# EAGLE design Board_v2_Round_Team_1 (EAGLE 8.1.0)
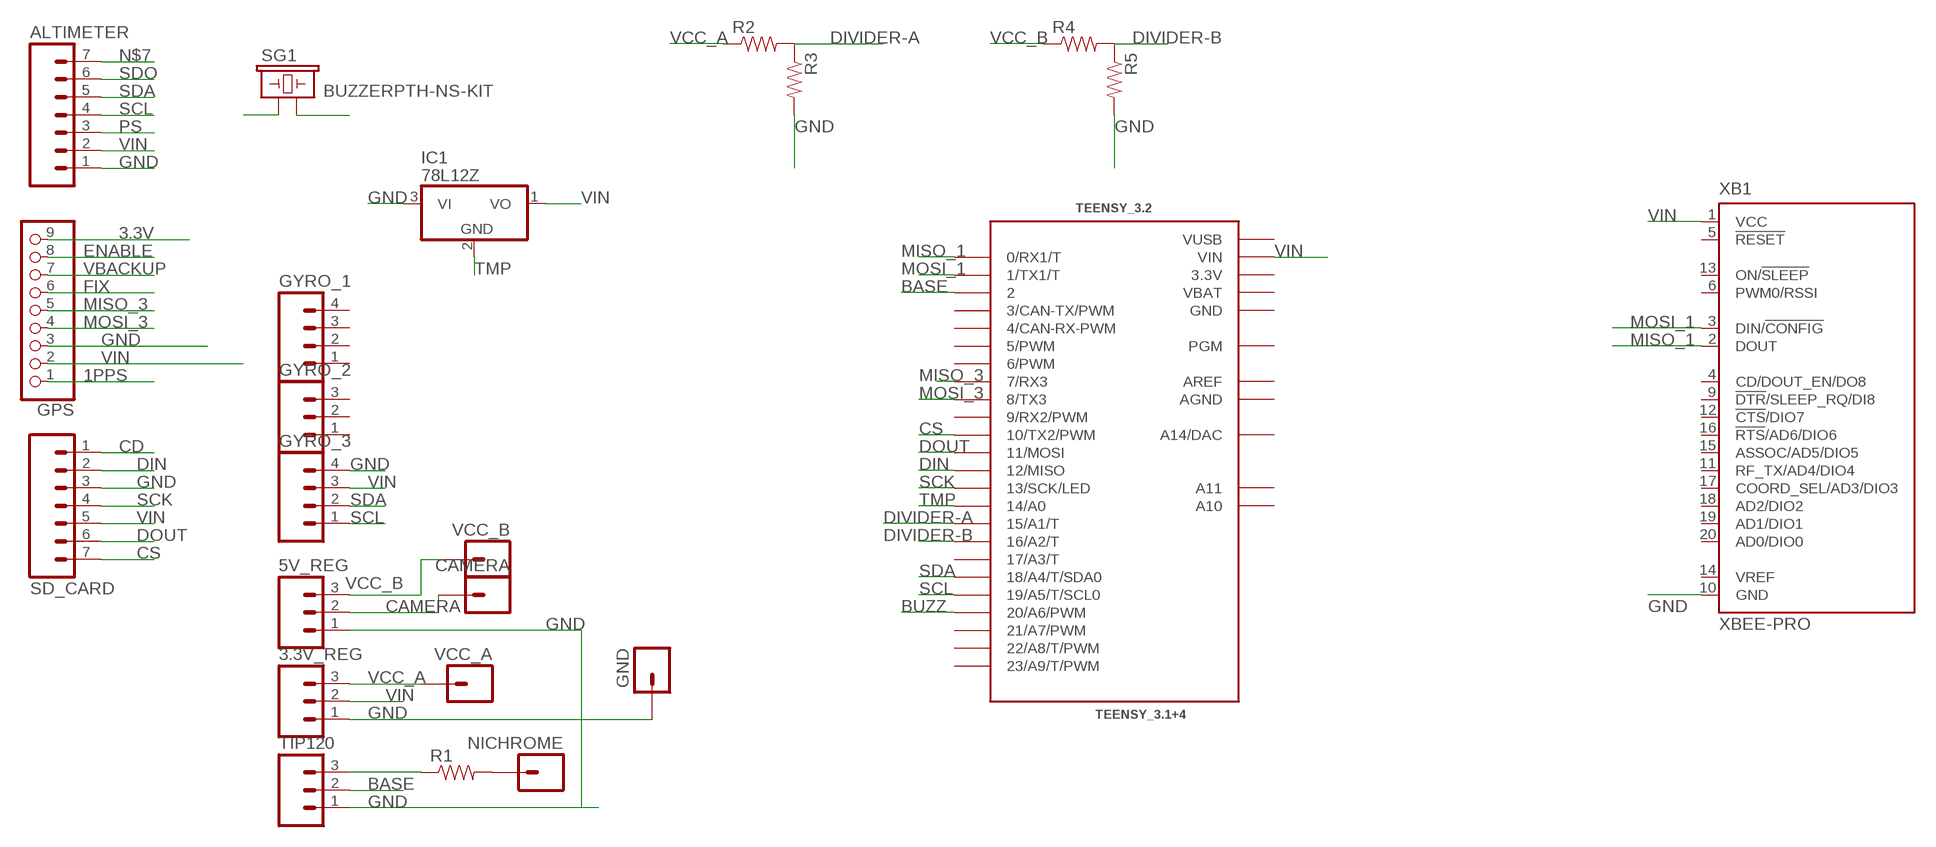
[diagram p0: schematic, sheet 1]

## Parts
3.3V_REG  M03PTH  [1X03]
5V_REG  M03PTH  [1X03]
ALTIMETER  M07  [1X07]
CAMERA  M01NOSILK-KIT  [1X01NS-KIT]
GND  M01PTH_LONGPAD  [1X01_LONGPAD]
GPS  HEADER-1X970MIL  [1X09_ROUND_70]
GYRO_1  M04PTH  [1X04]
GYRO_2  M03PTH  [1X03]
GYRO_3  M04PTH  [1X04]
IC1  78L12Z  [TO92]
NICHROME  M01PTH_LONGPAD  [1X01_LONGPAD]
R1  RESISTOREZ  [AXIAL-0.3EZ]
R2  RESISTORAXIAL-0.3  [AXIAL-0.3]
R3  RESISTORAXIAL-0.3  [AXIAL-0.3]
R4  RESISTORAXIAL-0.3  [AXIAL-0.3]
R5  RESISTORAXIAL-0.3  [AXIAL-0.3]
SD_CARD  M07  [1X07]
SG1  BUZZERPTH-NS-KIT  [BUZZER-12MM-NS-KIT]
TEENSY_3.2  TEENSY_3.1+4  [TEENSY_3.1+4]
TIP120  M03PTH  [1X03]
VCC_A  M01PTH_LONGPAD  [1X01_LONGPAD]
VCC_B  M01OFFSET  [1X01_OFFSET]
XB1  XBEE-PRO  [XBEE-PRO]

## Nets
1PPS: GPS.1
3.3V: GPS.9
BASE: TEENSY_3.2.2 TIP120.2
BUZZ: SG1.+ TEENSY_3.2.20/A6(20/A6/PWM)
CAMERA: 5V_REG.2 CAMERA.1
CD: SD_CARD.1
CS: SD_CARD.7 TEENSY_3.2.10(10/TX2/PWM)
DIN: SD_CARD.2 TEENSY_3.2.12(12/MISO)
DIVIDER-A: R2.P$2 R3.P$1 TEENSY_3.2.15/A1(15/A1/T)
DIVIDER-B: R4.P$2 R5.P$1 TEENSY_3.2.16/A2(16/A2/T)
DOUT: SD_CARD.6 TEENSY_3.2.11(11/MOSI)
ENABLE: GPS.8
FIX: GPS.6
GND: 3.3V_REG.1 5V_REG.1 ALTIMETER.1 GND.1 GPS.3 GYRO_3.4 IC1.3(VI) R3.P$2 R5.P$2 SD_CARD.3 SG1.- TIP120.1 XB1.10(GND)
MISO_1: TEENSY_3.2.0(0/RX1/T) XB1.2(DOUT)
MISO_3: GPS.5 TEENSY_3.2.7(7/RX3)
MOSI_1: TEENSY_3.2.1(1/TX1/T) XB1.3(DIN/!CONFIG)
MOSI_3: GPS.4 TEENSY_3.2.8(8/TX3)
N$1: NICHROME.1 R1.P$2
N$2: R1.P$1 TIP120.3
N$7: ALTIMETER.7
PS: ALTIMETER.3
SCK: SD_CARD.4 TEENSY_3.2.13(13/SCK/LED)
SCL: ALTIMETER.4 GYRO_3.1 TEENSY_3.2.19/A5(19/A5/T/SCL0)
SDA: ALTIMETER.5 GYRO_3.2 TEENSY_3.2.18/A4(18/A4/T/SDA0)
SDO: ALTIMETER.6
TMP: IC1.2(GND) TEENSY_3.2.14/A0
VBACKUP: GPS.7
VCC_A: 3.3V_REG.3 R2.P$1 VCC_A.1
VCC_B: 5V_REG.3 R4.P$1 VCC_B.1
VIN: 3.3V_REG.2 ALTIMETER.2 GPS.2 GYRO_3.3 IC1.1(VO) SD_CARD.5 TEENSY_3.2.VIN XB1.1(VCC)
Unconnected: GYRO_1.1 GYRO_1.2 GYRO_1.3 GYRO_1.4 GYRO_2.1 GYRO_2.2 GYRO_2.3 TEENSY_3.2.3(3/CAN-TX/PWM) TEENSY_3.2.4(4/CAN-RX-PWM) TEENSY_3.2.5(5/PWM) TEENSY_3.2.6(6/PWM) TEENSY_3.2.9(9/RX2/PWM) TEENSY_3.2.17/A3(17/A3/T) TEENSY_3.2.21/A7(21/A7/PWM) TEENSY_3.2.22/A8(22/A8/T/PWM) TEENSY_3.2.23/A9(23/A9/T/PWM) TEENSY_3.2.A10 TEENSY_3.2.A11 TEENSY_3.2.A14(A14/DAC) TEENSY_3.2.PGM XB1.4(CD/DOUT_EN/DO8) XB1.5(!RESET) XB1.6(PWM0/RSSI) XB1.9(!DTR!/SLEEP_RQ/DI8) XB1.11(RF_TX/AD4/DIO4) XB1.12(!CTS!/DIO7) XB1.13(ON/!SLEEP) XB1.14(VREF) XB1.15(ASSOC/AD5/DIO5) XB1.16(!RTS!/AD6/DIO6) XB1.17(COORD_SEL/AD3/DIO3) XB1.18(AD2/DIO2) XB1.19(AD1/DIO1) XB1.20(AD0/DIO0)

## Power pins joined to a net without a drawn wire
3.3V: TEENSY_3.2.3.3V TEENSY_3.2.3.3V1(3.3V)
AGND: TEENSY_3.2.AGND
AREF: TEENSY_3.2.AREF
GND: TEENSY_3.2.GND TEENSY_3.2.GND1(GND)
VBAT: TEENSY_3.2.VBAT
VUSB: TEENSY_3.2.VUSB

## Library data of the parts
3.3V_REG 5V_REG GYRO_2 TIP120 = SparkFun-Connectors:M03: Header 3 Standard 3-pin 0.1" header. Use with straight break away headers (SKU : PRT-00116), right angle break away headers (PRT-00553), swiss pins (PRT-00743), machine pins (PRT-00117), and female headers (PRT-00115). Molex polarized connector foot print use with SKU : PRT-08232 with associated crimp pins and housings.
ALTIMETER SD_CARD = SparkFun-Connectors:M07: Header 7 Standard 7-pin 0.1" header. Use with straight break away headers (SKU : PRT-00116), right angle break away headers (PRT-00553), swiss pins (PRT-00743), machine pins (PRT-00117), and female headers (PRT-00115). NOTES ON THE VARIANTS LOCK and LOCK_LONGPADS... This footprint was designed to help hold the alignment of a through-hole component (i.e. 7-pin header) while soldering it into place. You may notice that each hole has been shifted either up or down by 0.005 of an inch from it's more standard position (which is usually a perfectly straight line). This slight alteration caused the pins (the squares in the middle) to touch the edges of the holes. Because they are alternating, it causes a "brace" to hold the header in place. 0.005 has proven to be the perfect amount of "off-center" position when using our standard breakaway headers. Although looks a little odd when you look at the bare footprint, once you have a header in there, the alteration is very hard to notice. Also, if you push a header all the way into place, it is covered up entirely on the bottom side. This idea of altering the position of holes to aid alignment will be further integrated into the Sparkfun Library for other footprints. It can help hold any component with 3 or more connection pins.
CAMERA GND NICHROME VCC_A VCC_B = SparkFun-Connectors:M01: Header 1 Standard 1-pin 0.1" header. Use with straight break away headers (SKU : PRT-00116), right angle break away headers (PRT-00553), swiss pins (PRT-00743), machine pins (PRT-00117), and female headers (PRT-00115). SMTSO-256-ET is a "flush mount" nut for a 4-40 screw. The older package used to be too tight, and did not allow it to sit properly thru the drill hit. The latest (0.165DIA) fits nice and snug.
GPS = microbuilder:HEADER-1X9: PIN HEADER
GYRO_1 GYRO_3 = SparkFun-Connectors:M04: Header 4 Standard 4-pin 0.1" header. Use with straight break away headers (SKU : PRT-00116), right angle break away headers (PRT-00553), swiss pins (PRT-00743), machine pins (PRT-00117), and female headers (PRT-00115). Molex polarized connector foot print use with SKU : PRT-08231 with associated crimp pins and housings. 1MM SMD Version SKU: PRT-10208; PROD_ID: CONN-09696
IC1 = adafruit:78*: Positive VOLTAGE REGULATOR Added bigger pads to the TO-92 package
R1 = SparkFun-Passives:RESISTOR: Resistor Basic schematic elements and footprints for 0603, 1206, and PTH resistors.
R2-R5 = SparkFun-Resistors:RESISTOR: Resistor Basic schematic elements and footprints for 0603, 1206, and PTH resistors.
SG1 = SparkFun:BUZZER: Buzzer 12mm Spark Fun Electronics SKU : Comp-Buzzer
TEENSY_3.2 = Teensy_3_Series_Board_v1.0:TEENSY_3.1+4: Footprint for Teensy 3.1 board using all through-holes, i.e. the entire perimeter plus the 4 through-holes inboard (A10,A11,AREF, VUSB)
XB1 = maxstream:XBEE: XBee (TM) /XBee-PRO(TM) OEM RF Modules Source: MaxStream, Inc. xbee_productmanual.pdf; MPN: XBP24-AWI-001; OC_FARNELL: 1337916; OC_NEWARK: 42M2667

## Board
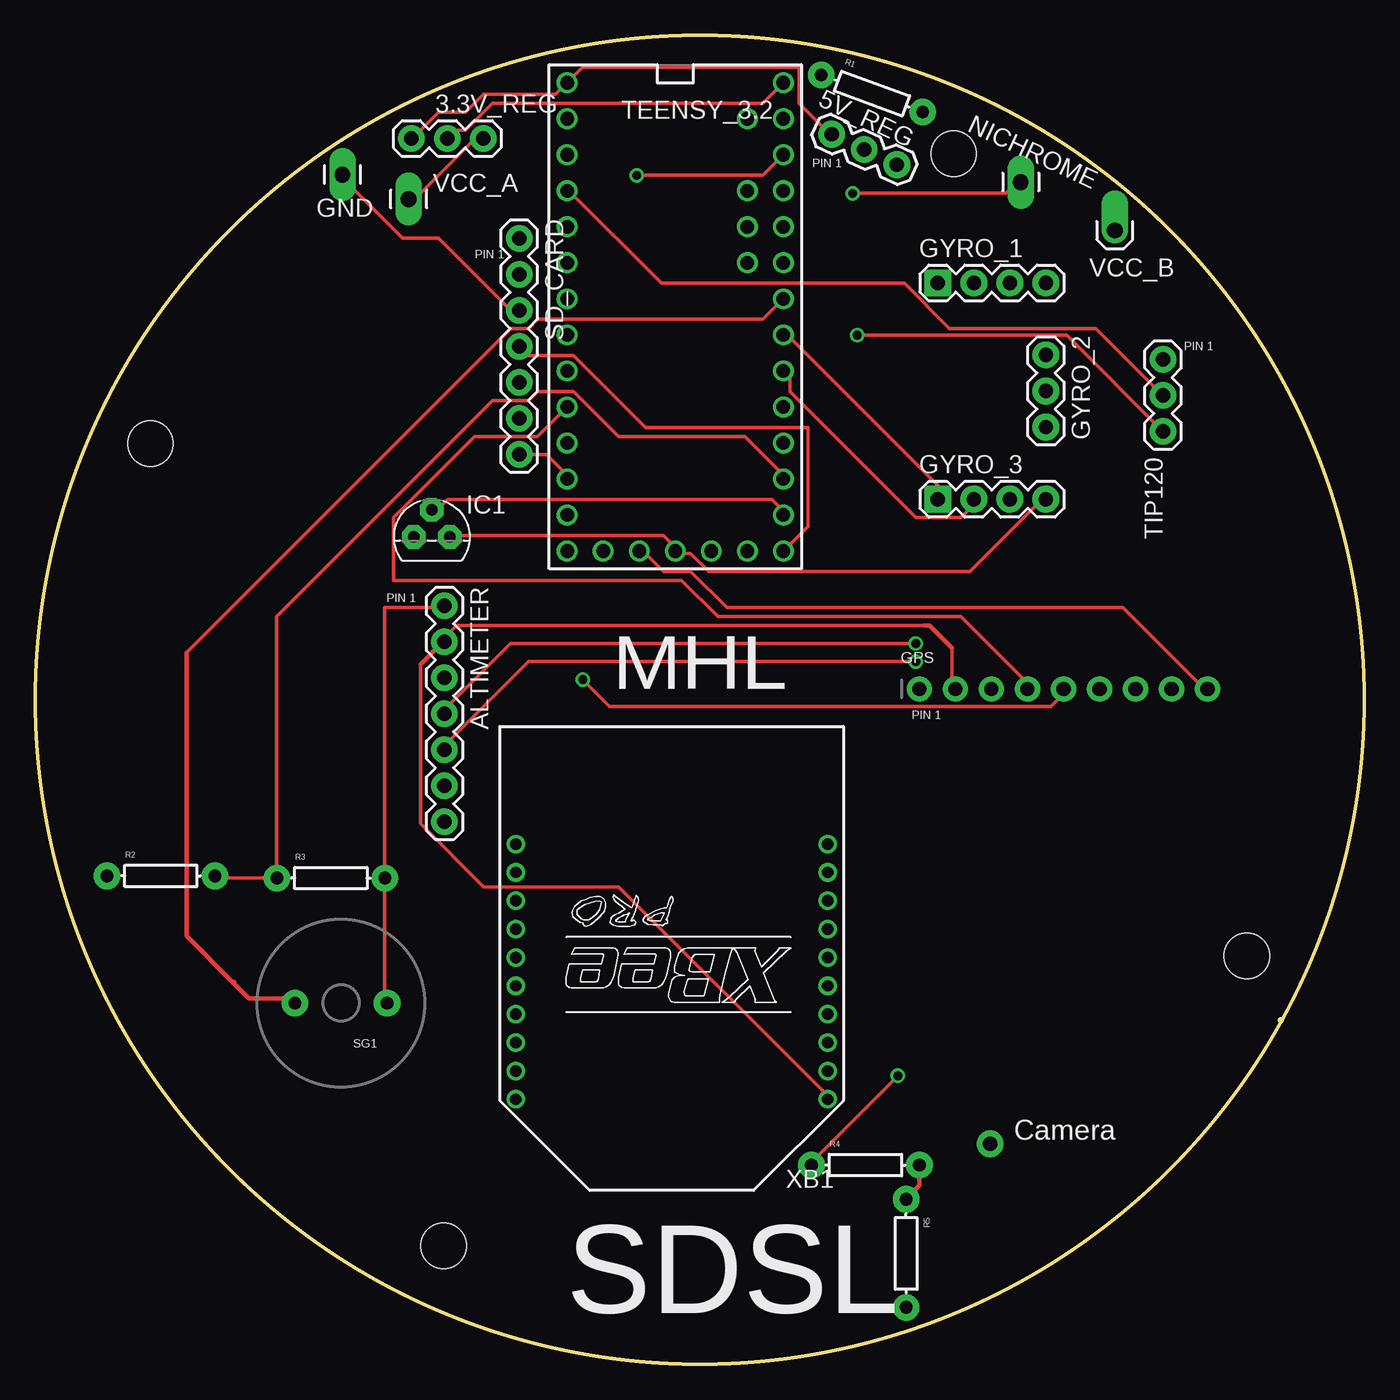
[diagram p1: board, top side]
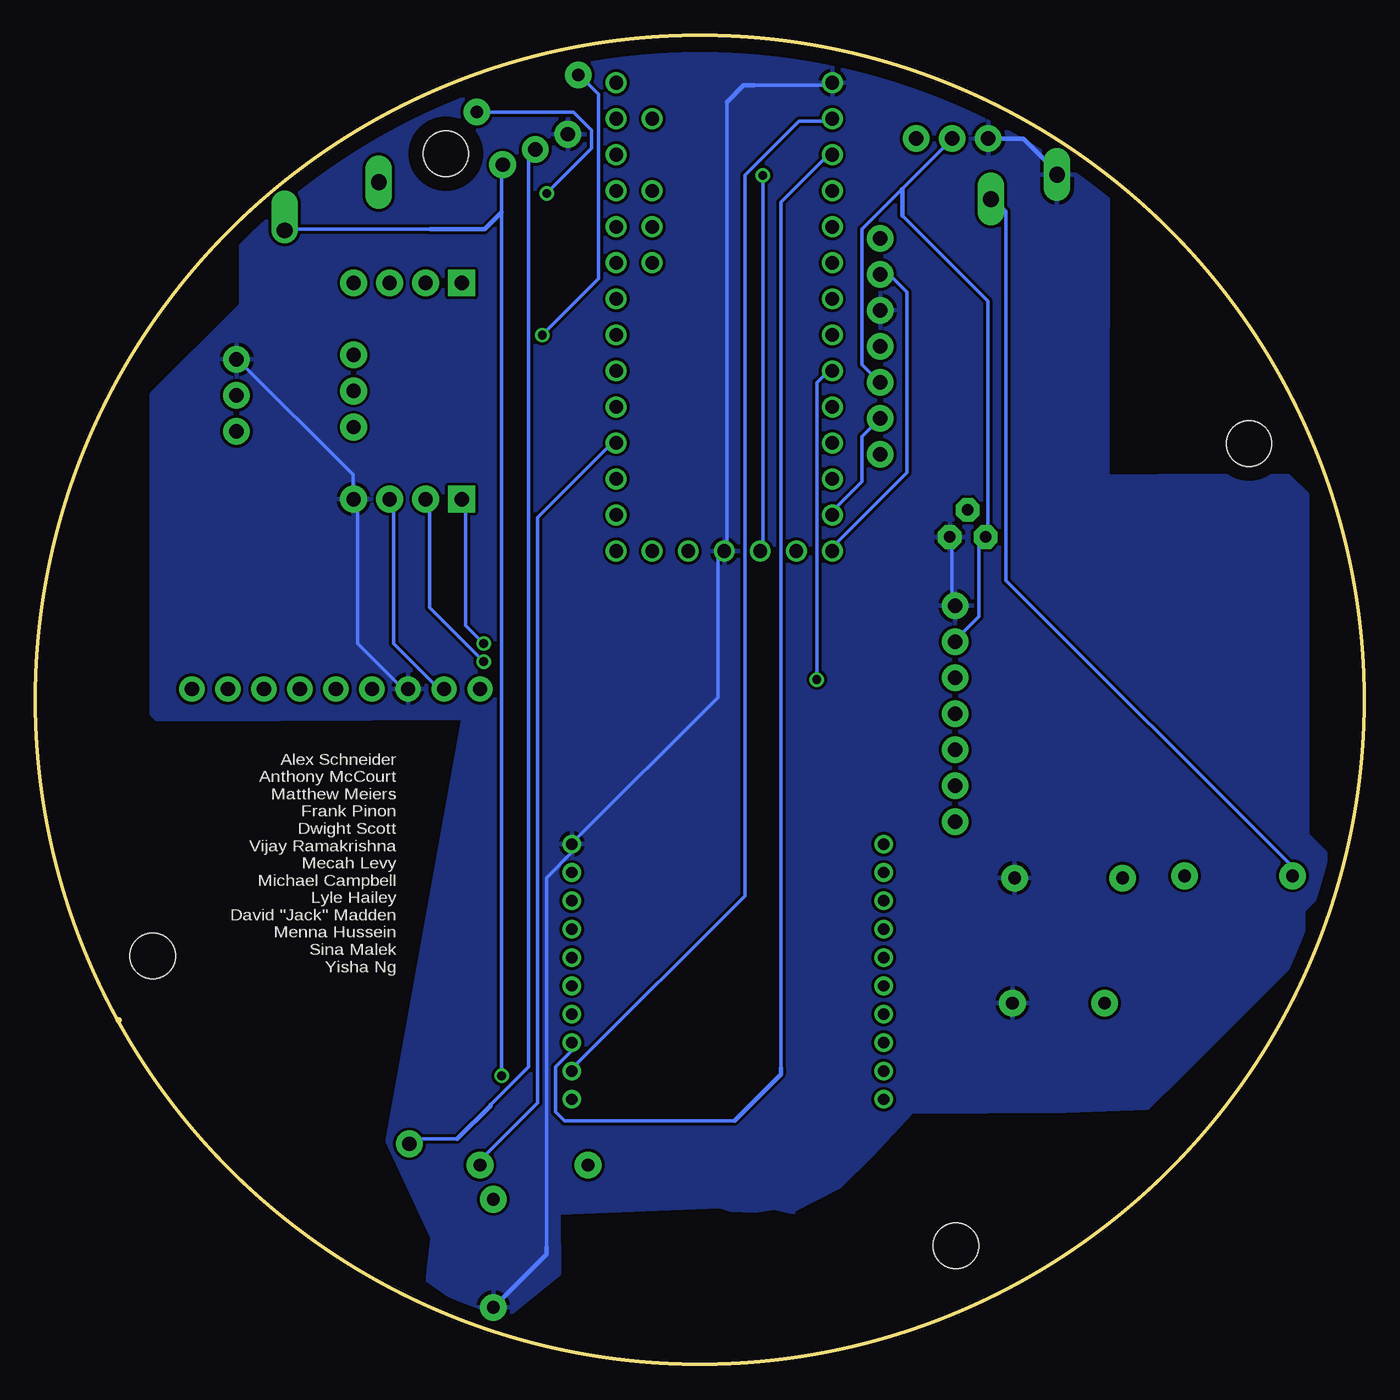
[diagram p2: board, bottom side, seen from below]

Size 93.69 x 93.69 mm. Coordinates in mm from the lower left corner, seen from the top.
Outline: 87.82,24.26 87.81,24.24
Outline: circle at 46.84,46.84 radius 46.84
Copper layers (1*16): Top 0.035mm / dielectric 1.5mm / Bottom 0.035mm
Design rules "default": minimum track width 10mil, minimum drill 24mil, track to track 8mil, track to pad 8mil, pad to pad 8mil, via to via 8mil, smd to smd 8mil, copper to edge 40mil, drill to drill 8mil, minimum pad ring 10mil, minimum via ring 8mil, stop-mask expansion 4mil, vias tented up to drill 0mil, thermal gap 10mil
Holes 3.2 mm at 64.75,85.35 85.43,28.78 8.11,64.9 28.78,8.34

### Footprints (pad centres in the part's own frame; a part is rotated, then mirrored left to right if it is on the bottom)
1X03 = drill 1.016 pad 1.88: 1 0,0; 2 2.54,0; 3 5.08,0
1X07 = drill 1.016 pad 1.88: 1 0,0; 2 2.54,0; 3 5.08,0; 4 7.62,0; 5 10.16,0; 6 12.7,0; 7 15.24,0
1X01NS-KIT = drill 1.016 pad 1.88: 1 0,0
1X01_LONGPAD = drill 1.118 pad 1.88 long: 1 0,0
1X09_ROUND_70 = drill 1 pad 1.778: 1 -10.16,0; 2 -7.62,0; 3 -5.08,0; 4 -2.54,0; 5 0,0; 6 2.54,0; 7 5.08,0; 8 7.62,0; 9 10.16,0
1X04 = drill 1.016 pad 1.88 square: 1 0,0 | drill 1.016 pad 1.88: 2 2.54,0; 3 5.08,0; 4 7.62,0
TO92 = drill 0.813 pad 1.676 octagon: 1 -1.27,0; 2 0,1.905; 3 1.27,0
AXIAL-0.3EZ = drill 0.9 pad 1.88: P$1 -3.81,0; P$2 3.81,0
AXIAL-0.3 = drill 0.9 pad 1.88: P$1 -3.81,0; P$2 3.81,0
BUZZER-12MM-NS-KIT = drill 0.9 pad 1.88: + 3.25,0; - -3.25,0
TEENSY_3.1+4 = drill 0.965: 0 -7.62,15.24; 1 -7.62,12.7; 2 -7.62,10.16; 3 -7.62,7.62; 3.3V 7.62,12.7; 3.3V1 -2.54,-15.24; 4 -7.62,5.08; 5 -7.62,2.54; 6 -7.62,0; 7 -7.62,-2.54; 8 -7.62,-5.08; 9 -7.62,-7.62; 10 -7.62,-10.16; 11 -7.62,-12.7; 12 -7.62,-15.24; 13 7.62,-15.24; 14/A0 7.62,-12.7; 15/A1 7.62,-10.16; 16/A2 7.62,-7.62; 17/A3 7.62,-5.08; 18/A4 7.62,-2.54; 19/A5 7.62,0; 20/A6 7.62,2.54; 21/A7 7.62,5.08; 22/A8 7.62,7.62; 23/A9 7.62,10.16; A10 5.08,7.62; A11 5.08,5.08; A14 5.08,-15.24; AGND 7.62,15.24; AREF 5.08,10.16; GND -7.62,17.78; GND1 0,-15.24; PGM 2.54,-15.24; VBAT -5.08,-15.24; VIN 7.62,17.78; VUSB 5.08,15.24
1X01_OFFSET = drill 1.118 pad 1.88 offset: 1 0,0
XBEE-PRO = drill 0.8 pad 1.27: 1 -11,9; 2 -11,7; 3 -11,5; 4 -11,3; 5 -11,1; 6 -11,-1; 7 -11,-3; 8 -11,-5; 9 -11,-7; 10 -11,-9; 11 11,-9; 12 11,-7; 13 11,-5; 14 11,-3; 15 11,-1; 16 11,1; 17 11,3; 18 11,5; 19 11,7; 20 11,9

### Placement (x,y rotation side)
3.3V_REG  26.5,86.42 0 top
5V_REG  56.14,86.72 335 top
ALTIMETER  28.84,53.47 270 top
CAMERA  67.32,15.53 0 top
GND  21.65,83.88 180 top
GPS  72.5,47.61 0 top
GYRO_1  63.63,76.23 0 top
GYRO_2  71.25,71.15 270 top
GYRO_3  63.63,60.99 0 top
IC1  27.95,58.32 0 top
NICHROME  69.48,83.34 0 top
R1  58.99,89.59 340 top
R2  8.85,34.42 0 top
R3  20.83,34.27 0 top
R4  58.53,14.03 0 top
R5  61.4,7.8 270 top
SD_CARD  34.12,79.38 270 top
SG1  21.55,25.46 180 top
TEENSY_3.2  45.12,72.57 0 top
TIP120  79.51,70.85 270 top
VCC_A  26.32,82.15 180 top
VCC_B  76.1,79.94 0 top
XB1  44.86,27.67 180 top

### Tracks (layer width: path | path; a pad name or v marks a point on that pad's centre or on a via)
3.3V  (via drill 0.61)
  Top 0.254: TEENSY_3.2.3.3V1 43.03,57.16 44.3,55.89 46.21,55.89 48.75,53.35 76.69,53.35 82.4,47.63 GPS.9 | TEENSY_3.2.3.3V 51.29,83.83 v42.4,83.83
  Bottom 0.254: v42.4,83.83 42.4,57.79 TEENSY_3.2.3.3V1
BASE
  Top 0.254: TIP120.2 74.78,73.03 64.47,73.03 61.29,76.21 44.15,76.21 37.64,82.72 TEENSY_3.2.2
BUZZ
  Top 0.254: TEENSY_3.2.20/A6 51.29,73.67 35.41,73.67 34.78,73.03 33.51,73.03 10.65,50.17 | SG1.+ 18.27,26.04 | 14,26.93 13.98,26.99 13.91,26.92
  Top 0.305: 14,26.93 14,26.83 | SG1.+ 17.97,25.79 15.04,25.79 13.91,26.92 10.65,30.18 10.65,50.17
CAMERA
  Bottom 0.254: 63.94,15.88 67.16,15.88 CAMERA.1 | 61.6,18.27 58.91,20.96 58.91,85.1 5V_REG.2
  Bottom 0.305: 61.6,18.27 61.6,18.22 63.94,15.88
CS
  Top 0.254: SD_CARD.7 36.05,64.14 37.32,62.87 TEENSY_3.2.10
DIN
  Bottom 0.254: TEENSY_3.2.12 37.32,57.79 32.24,62.87 32.24,75.57 33.51,76.84 SD_CARD.2
DIVIDER-A
  Top 0.254: TEENSY_3.2.15/A1 52.56,62.87 50.02,65.41 41.13,65.41 37.95,68.59 35.41,68.59 34.78,67.95 32.24,67.95 17,52.71 17,34.3 R3.P$1 16.36,34.3 12.55,34.3 R2.P$2
DIVIDER-B
  Top 0.305: R4.P$2 62.34,12.6 61.4,11.67 R5.P$1
  Bottom 0.254: TEENSY_3.2.16/A2 53.19,64.78 58.27,59.7 58.27,18.42 62.08,14.61 R4.P$2
DOUT
  Bottom 0.254: TEENSY_3.2.11 37.32,60.33 35.41,62.24 35.41,65.41 34.14,66.68 SD_CARD.6
GND
  Top 0.254: 3.3V_REG.1 26.52,87 27.16,87 28.43,88.27 30.33,88.27 31.6,89.54 36.68,89.54 TEENSY_3.2.GND 38.59,91.45 53.83,91.45 53.83,88.91 55.73,87 5V_REG.1 | SD_CARD.3 33.51,74.3 28.43,79.38 25.89,79.38 21.44,83.83 GND.1 | SG1.- 24.62,26.04 24.62,33.66 R3.P$2 24.62,34.3 24.62,53.35 28.43,53.35 ALTIMETER.1 | IC1.3 29.7,58.43 44.3,58.43 44.94,57.79 TEENSY_3.2.GND1 45.57,57.16 46.21,57.16 47.48,55.89 65.89,55.89 70.97,60.97 GYRO_3.4
  Bottom 0.254: 22.08,84.46 GND.1 | GPS.3 67.8,47.63 70.97,50.81 70.97,60.97 GYRO_3.4 71.29,61.13 71.29,62.71 79.39,70.81 TIP120.1 | IC1.3 29.06,57.79 29.06,53.98 ALTIMETER.1 | 57.64,8.26 57.64,34.3 55.73,36.2 XB1.10 55.73,36.84 45.57,47 45.57,57.16 TEENSY_3.2.GND1 44.94,57.79 44.94,88.98 | 42.98,90.18 37.95,90.18 TEENSY_3.2.GND
  Bottom 0.305: 42.98,90.18 43.75,90.18 44.94,88.98 | 3.3V_REG.1 24.04,86.42 22.08,84.46 | 57.64,8.26 57.64,7.75 R5.P$2
  pour Bottom: 45.37,11.11 56.8,10.65 56.78,6.38 61.4,2.62 66.02,5.9 65.67,8.95 68.87,15.73 63.48,45.55 76.44,45.5 85.15,45.5 85.48,45.83 85.48,68.38 79.18,74.68 79.18,80.47 77.12,82.53 77.02,82.53 76.21,83.34 76.05,83.34 75.77,83.62 75.65,83.62 75.01,84.26 74.81,84.26 74.23,84.84 74,84.84 73.51,85.33 73.36,85.33 72.93,85.76 72.65,85.76 72.32,86.09 72.07,86.09 71.84,86.32 71.33,86.32 71.08,86.57 70.67,86.57 70.44,86.8 69.78,86.8 69.3,87.28 69.07,87.28 68.92,87.43 67.55,87.43 66.94,88.04 66.71,88.04 66.28,88.47 65.26,88.47 64.93,88.8 64.88,88.8 64.34,89.34 64.22,89.34 63.68,89.87 63.25,89.87 63.15,89.97 61.8,89.97 61.2,90.58 60.99,90.58 60.61,90.96 58.63,90.96 57.39,92.21 54.79,92.21 54.36,92.64 37.45,92.64 37.01,92.21 35.57,92.21 34.8,91.45 32.06,91.45 31.3,90.68 30.28,90.68 28.99,89.39 27.57,89.39 27.03,88.86 26.3,88.86 25.74,88.3 25.18,88.3 24.54,87.66 24.06,87.66 23.25,86.85 22.41,86.85 21.75,86.19 21.57,86.19 21.14,85.76 20.73,85.76 20.38,85.4 20.38,85.22 20.33,85.17 20.17,85.17 19.97,84.97 19.74,84.97 19.26,84.49 19.26,83.83 18.07,82.63 18.07,79.66 18.12,66.38 18.09,62.59 11.03,62.64 10.85,62.62 5.34,62.62 4.02,61.3 4.02,37.29 2.75,36.02 2.75,33.53 4.3,31.99 4.3,29.01 12.83,20.48 15.27,18.07 21.04,17.86 31.91,17.79 34.75,14.74 36.99,12.53 40.32,10.83 40.24,10.7 41.59,11.03 42.96,10.8 44.63,10.88
MISO_1
  Bottom 0.254: XB1.2 55.73,20.96 43.67,33.03 43.67,83.83 39.86,87.64 37.95,87.64 TEENSY_3.2.0
MISO_3  (via drill 0.61)
  Top 0.254: v38.59,48.27 40.49,46.36 71.61,46.36 72.24,47 GPS.5
  Bottom 0.254: v38.59,48.27 38.59,69.22 37.95,69.86 TEENSY_3.2.7
MOSI_1
  Bottom 0.254: 44.41,17.15 56.37,17.15 57,17.79 57,20.96 55.73,22.23 XB1.3 | 41.13,20.89 41.13,81.92 37.95,85.1 TEENSY_3.2.1
  Bottom 0.305: 41.13,20.89 41.13,20.43 44.41,17.15
MOSI_3
  Top 0.254: TEENSY_3.2.8 35.41,65.41 30.97,65.41 25.25,59.7 25.25,55.25 45.57,55.25 48.11,52.71 65.26,52.71 70.34,47.63 GPS.4
N$1  (via drill 0.61)
  Top 0.254: v57.64,82.56 68.43,82.56 69.07,83.19 NICHROME.1
  Bottom 0.254: v57.64,82.56 54.46,85.73 54.46,87 55.73,88.27 62.08,88.27 R1.P$2
N$2  (via drill 0.61)
  Top 0.254: TIP120.3 72.72,72.56 v57.96,72.56
  Bottom 0.254: v57.96,72.56 53.99,76.52 53.99,89.54 55.26,90.81 R1.P$1
SCK
  Top 0.254: TEENSY_3.2.13 54.46,59.06 54.46,66.05 43.03,66.05 37.95,71.13 34.78,71.13 34.14,71.76 SD_CARD.4
SCL  (via drill 0.61)
  Top 0.254: TEENSY_3.2.19/A5 53.19,72.4 63.99,61.6 GYRO_3.1 | v62.08,50.81 33.51,50.81 29.06,46.36 ALTIMETER.4
  Bottom 0.254: v62.08,50.81 63.35,52.08 63.35,60.97 GYRO_3.1
SDA  (via drill 0.61)
  Top 0.254: TEENSY_3.2.18/A4 53.19,69.86 53.19,68.59 62.08,59.7 65.26,59.7 66.53,60.97 GYRO_3.2 | v62.08,49.54 34.78,49.54 29.06,43.82 ALTIMETER.5
  Bottom 0.254: v62.08,49.54 65.89,53.35 65.89,60.97 GYRO_3.2
TMP
  Top 0.254: TEENSY_3.2.14/A0 52.56,60.33 51.92,60.97 29.06,60.97 28.43,60.33 IC1.2
VCC_A
  Top 0.254: 3.3V_REG.3 30.97,86.37 27.16,82.56 26.52,82.56 VCC_A.1
  Bottom 0.254: R2.P$1 4.93,34.93 25.25,55.25 25.25,81.29 25.89,81.92 VCC_A.1
VCC_B  (via drill 0.61)
  Top 0.254: v60.81,20.33 55.1,14.61 R4.P$1
  Bottom 0.254: v60.81,20.33 60.81,81.24 60.81,84.46 5V_REG.3 | 65.87,80.02 76.05,80.02 VCC_B.1
  Bottom 0.305: 65.87,80.02 62.03,80.02 60.81,81.24
VIN
  Top 0.254: TEENSY_3.2.VIN 51.29,88.91 32.24,88.91 30.33,87 29.06,87 3.3V_REG.2 | 27.16,49.33 27.16,38.11 31.6,33.66 41.13,33.66 55.73,19.06 XB1.1 | 64.62,50.48 64.62,47.63 GPS.2 | 62.67,52.08 29.7,52.08 29.06,51.44 ALTIMETER.2
  Top 0.305: 62.67,52.08 63.02,52.08 64.62,50.48 | ALTIMETER.2 28.76,50.93 27.16,49.33
  Bottom 0.254: SD_CARD.5 34.14,69.22 35.41,70.49 35.41,80.02 32.58,82.85 29.06,86.37 3.3V_REG.2 | GPS.2 65.26,47.63 68.43,50.81 68.43,60.97 GYRO_3.3 | ALTIMETER.2 28.43,51.44 27.16,52.71 27.16,57.79 IC1.1 26.52,58.43 26.52,74.94 32.57,80.98
  Bottom 0.305: 32.58,82.85 32.57,82.84 32.57,80.98

### Text on the board
Measures: All units in inch | All units in inch
_tsilk: PIN 1 | PIN 1 | PIN 1 | PIN 1 | MHL | PIN 1 | Camera | SDSL
_bsilk: Alex Schneider / Anthony McCourt / Matthew Meiers / Frank Pinon / Dwight Scott / Vijay Ramakrishna / Mecah Levy / Michael Campbell / Lyle Hailey / David "Jack" Madden / Menna Hussein / Sina Malek / Yisha Ng